# Altium schematic sheet 4.POWER_48_TO_12.SchDoc
size A4
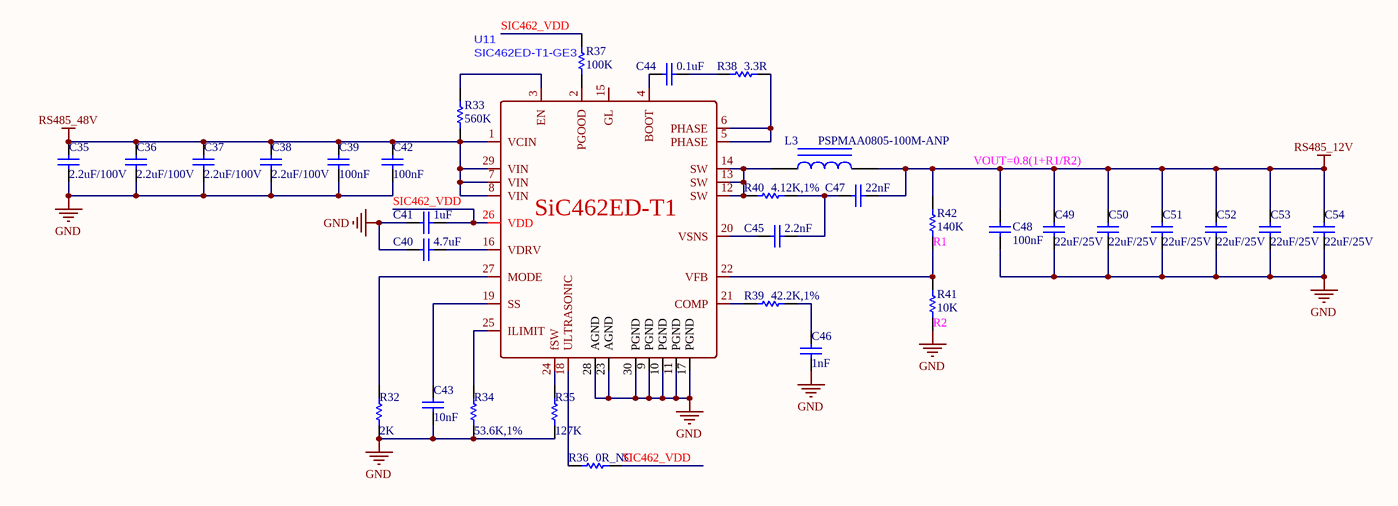
[diagram p0: 4.POWER_48_TO_12.SchDoc]

## Parts
C35  2.2uF/100V  [1206C]
C36  2.2uF/100V  [1206C]
C37  2.2uF/100V  [1206C]
C38  2.2uF/100V  [1206C]
C39  100nF  [0402]
C40  4.7uF  [0402]
C41  1uF  [0402]
C42  100nF  [0402]
C43  10nF  [0402]
C44  0.1uF  [0402]
C45  2.2nF  [0402]
C46  1nF  [0402]
C47  22nF  [0402]
C48  100nF  [0402]
C49  22uF/25V  [0805C]
C50  22uF/25V  [0805C]
C51  22uF/25V  [0805C]
C52  22uF/25V  [0805C]
C53  22uF/25V  [0805C]
C54  22uF/25V  [0805C]
L3  PSPMAA0805-100M-ANP  [IND-SMD_L8.5-W8.0_PCC-M0854M]
R32  2K  [0402]
R33  560K  [0402]
R34  53.6K,1%  [0402]
R35  127K  [0402]
R36  0R_NC  [0402]
R37  100K  [0402]
R38  3.3R  [0402]
R39  42.2K,1%  [0402]
R40  4.12K,1%  [0402]
R41  10K  [0402]
R42  140K  [0402]
U11  SIC462ED-T1-GE3  [MLP55-27_L5.0-W5.0-P0.50-TL_SIC46XXX]

## Nets
GND: C35.2 C36.2 C37.2 C38.2 C39.2 C40.2 C41.2 C42.2 C43.1 C46.1 C48.2 C49.2 C50.2 C51.2 C52.2 C53.2 C54.2 R32.2 R34.2 R35.2 R41.1 U11.9(PGND) U11.10(PGND) U11.11(PGND) U11.17(PGND) U11.23(AGND) U11.28(AGND) U11.30(PGND)
RS485_12V: C47.2 C48.1 C49.1 C50.1 C51.1 C52.1 C53.1 C54.1 L3.2 R42.2
RS485_48V: C35.1 C36.1 C37.1 C38.1 C39.1 C42.1 R33.1 U11.1(VCIN) U11.7(VIN) U11.8(VIN) U11.29(VIN)
SIC462_VDD: C41.1 R36.1 R37.2 U11.26(VDD)
NetC40_1: C40.1 U11.16(VDRV)
NetC43_2: C43.2 U11.19(SS)
NetC44_1: C44.1 R38.1
NetC44_2: C44.2 U11.4(BOOT)
NetC45_1: C45.1 C47.1 R40.2
NetC45_2: C45.2 U11.20(VSNS)
NetC46_2: C46.2 R39.2
NetL3_1: L3.1 R40.1 U11.12(SW) U11.13(SW) U11.14(SW)
NetR32_1: R32.1 U11.27(MODE)
NetR33_2: R33.2 U11.3(EN)
NetR34_1: R34.1 U11.25(ILIMIT)
NetR35_1: R35.1 U11.24(fSW)
NetR36_2: R36.2 U11.18(ULTRASONIC)
NetR37_1: R37.1 U11.2(PGOOD)
NetR38_2: R38.2 U11.5(PHASE) U11.6(PHASE)
NetR39_1: R39.1 U11.21(COMP)
NetR41_2: R41.2 R42.1 U11.22(VFB)

Not connected (* = marked no-connect by the designer): U11 15(GL)

## Notes on the sheet
- VOUT=0.8(1+R1/R2)
- (near R42) R1
- (near R41) R2
- (in symbol SIC462ED-T1-GE3) SiC462ED-T1

## Library data of the parts
C35-C54 = Cap: Capacitor; PartNumber: CAP100NF; Published: 8-Jun-2000; LatestRevisionDate: 17-Jul-2002; LatestRevisionNote: Re-released for DXP Platform.; PackageReference: 0402; Publisher: Altium Limited
  C35-C38: Value: 2.2uF/100V
  C39 C42 C48: Value: 100nF
  C40: Value: 4.7uF
  C41: Value: 1uF
  C43: Value: 10nF
  C44: Value: 0.1uF
  C45: Value: 2.2nF
  C46: Value: 1nF
  C47: Value: 22nF
  C49-C54: Value: 22uF/25V
L3 = 0603 3.9nH 0.3nH: 贴片电感; ComponentLink1Description: 供应商链接; Supplier: LC; JLC NO: C2962885; Value: PSPMAA0805-100M-ANP
R32-R42 = Res1: Resistor; PartNumber: RES22R; Published: 8-Jun-2000; LatestRevisionDate: 17-Jul-2002; LatestRevisionNote: Re-released for DXP Platform.; PackageReference: 0402; Publisher: Altium Limited
  R32: Value: 2K
  R33: Value: 560K
  R34: Value: 53.6K,1%
  R35: Value: 127K
  R36: Value: 0R_NC
  R37: Value: 100K
  R38: Value: 3.3R
  R39: Value: 42.2K,1%
  R40: Value: 4.12K,1%
  R41: Value: 10K
  R42: Value: 140K
U11 = SIC462ED-T1-GE3: JLC NO: C335617